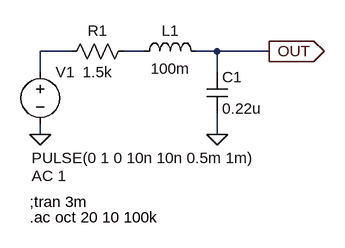
[diagram p0: schematic MIDI_CV_CONV_Output_LPF.asc]
MIDI_CV_CONV_Output_LPF.asc, the LTspice schematic file:
Version 4
SHEET 1 880 680
WIRE 80 96 32 96
WIRE 192 96 160 96
WIRE 304 96 272 96
WIRE 384 96 304 96
WIRE 32 128 32 96
WIRE 304 128 304 96
WIRE 32 224 32 208
WIRE 304 224 304 192
FLAG 32 224 0
FLAG 304 224 0
FLAG 384 96 OUT
IOPIN 384 96 Out
SYMBOL res 176 80 R90
WINDOW 0 0 56 VBottom 2
WINDOW 3 32 56 VTop 2
SYMATTR InstName R1
SYMATTR Value 1.5k
SYMBOL ind 176 112 R270
WINDOW 0 32 56 VTop 2
WINDOW 3 5 56 VBottom 2
SYMATTR InstName L1
SYMATTR Value 100m
SYMBOL cap 288 128 R0
SYMATTR InstName C1
SYMATTR Value 0.22u
SYMBOL voltage 32 112 R0
WINDOW 3 -13 148 Left 2
WINDOW 123 -13 176 Left 2
WINDOW 39 0 0 Left 2
SYMATTR Value PULSE(0 1 0 10n 10n 0.5m 1m)
SYMATTR Value2 AC 1
SYMATTR InstName V1
TEXT 16 328 Left 2 !;tran 3m
TEXT 16 352 Left 2 !.ac oct 20 10 100k

The netlist it stands for:
* MIDI_CV_CONV_Output_LPF.asc
R1 N002 N001 1.5k
L1 N002 OUT 100m
C1 OUT 0 0.22u
V1 N001 0 PULSE(0 1 0 10n 10n 0.5m 1m) AC 1
;tran 3m
.ac oct 20 10 100k
.backanno
.end